# EAGLE design generator (EAGLE 6.5.0)
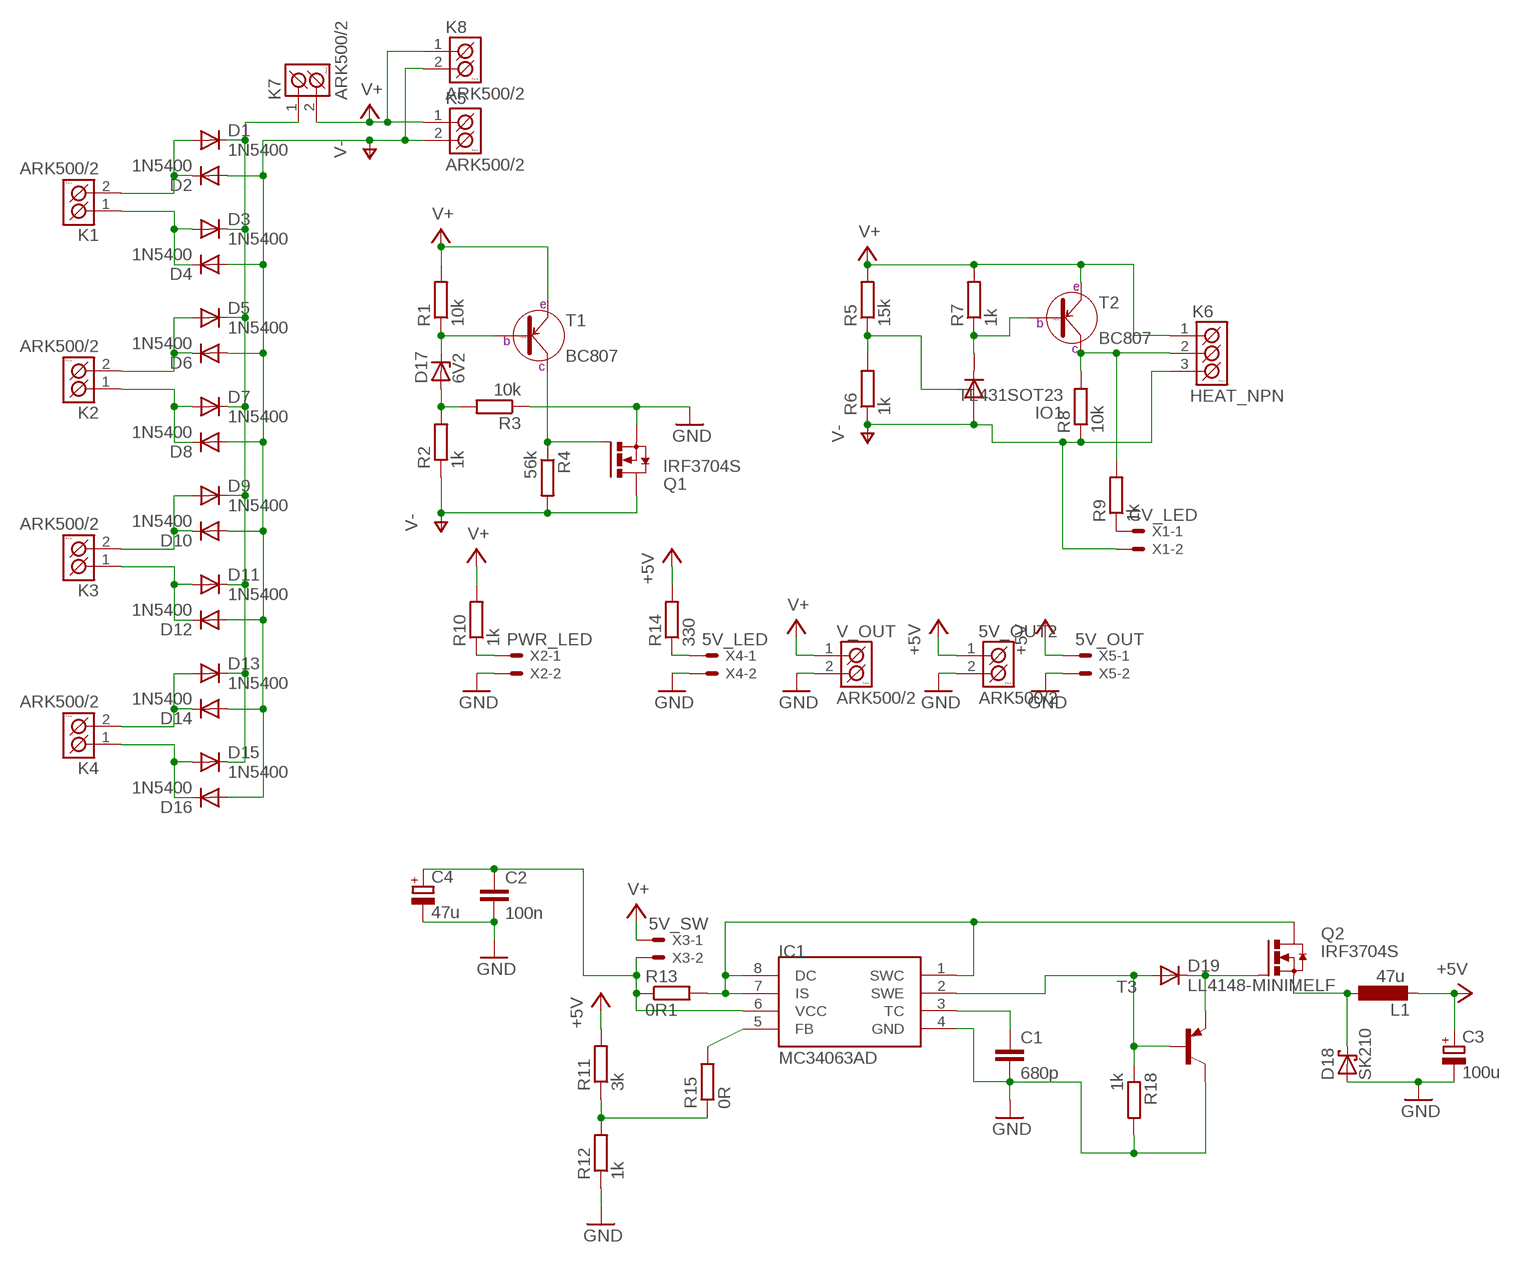
[diagram p0: schematic, sheet 1]

## Parts
5V_OUT2  ARK500/2  [ARK500/2]
C1  680p  C-EUC0805  [C0805]
C2  100n  C-EUC0805  [C0805]
C3  100u  CPOL-EUD  [PANASONIC_D]
C4  47u  CPOL-EUD  [PANASONIC_D]
D1  1N5400  [DO201-15]
D2  1N5400  [DO201-15]
D3  1N5400  [DO201-15]
D4  1N5400  [DO201-15]
D5  1N5400  [DO201-15]
D6  1N5400  [DO201-15]
D7  1N5400  [DO201-15]
D8  1N5400  [DO201-15]
D9  1N5400  [DO201-15]
D10  1N5400  [DO201-15]
D11  1N5400  [DO201-15]
D12  1N5400  [DO201-15]
D13  1N5400  [DO201-15]
D14  1N5400  [DO201-15]
D15  1N5400  [DO201-15]
D16  1N5400  [DO201-15]
D17  6V2  ZENER-DIODESOD80C  [SOD80C]
D18  SK210  SCHOTTKY-DIODESMD  [SMB]
D19  LL4148-MINIMELF  PMLL41SOD80C  [SOD80C]
IC1  MC34063AD  [SOIC8]
IO1  TL431SOT23  [SOT23]
K1  ARK500/2  [ARK500/2]
K2  ARK500/2  [ARK500/2]
K3  ARK500/2  [ARK500/2]
K4  ARK500/2  [ARK500/2]
K5  ARK500/2  [ARK500/2]
K6  HEAT_NPN  ARK500/3  [ARK500/3]
K7  ARK500/2  [ARK500/2]
K8  ARK500/2  [ARK500/2]
L1  47u  L-EUTJ3-U1  [TJ3-U1]
Q1  IRF3704S  [D2PACK]
Q2  IRF3704S  [D2PACK]
R1  10k  R-EU_R0805  [R0805]
R2  1k  R-EU_R0805  [R0805]
R3  10k  R-EU_R0805  [R0805]
R4  56k  R-EU_R0805  [R0805]
R5  15k  R-EU_R0805  [R0805]
R6  1k  R-EU_R0805  [R0805]
R7  1k  R-EU_R0805  [R0805]
R8  10k  R-EU_R0805  [R0805]
R9  1k  R-EU_R0805  [R0805]
R10  1k  R-EU_R0805  [R0805]
R11  3k  R-EU_R0805  [R0805]
R12  1k  R-EU_R0805  [R0805]
R13  0R1  R-EU_R0805  [R0805]
R14  330  R-EU_R0805  [R0805]
R15  0R  R-EU_R1206  [R1206]
R18  1k  R-EU_R0805  [R0805]
T1  BC807  [SOT-23]
T2  BC807  [SOT-23]
T3  BC807-16-PNP-SOT23-BEC  [SOT23-BEC]
V_OUT  ARK500/2  [ARK500/2]
X1  CV_LED  22-23-2021  [22-23-2021]
X2  PWR_LED  22-23-2021  [22-23-2021]
X3  5V_SW  22-23-2021  [22-23-2021]
X4  5V_LED  22-23-2021  [22-23-2021]
X5  5V_OUT  22-23-2021  [22-23-2021]

## Nets
+5V: 5V_OUT2.1(K1) C3.+ L1.2 R11.2 R14.2 X5.1
GND: 5V_OUT2.2(K2) C1.2 C2.2 C3.- C4.- D18.A IC1.4(GND) Q1.3(S) R3.1 R12.1 R18.2 T3.C V_OUT.2(K2) X2.2 X4.2 X5.2
N$1: D1.A D2.C K1.2(K2)
N$2: D3.A D4.C K1.1(K1)
N$3: IO1.1(C) R7.1 T2.1(B)
N$4: Q1.1(G) R4.1 T1.3(C)
N$5: D5.A D6.C K2.2(K2)
N$6: D7.A D8.C K2.1(K1)
N$7: K6.2(K2) R8.2 R9.2 T2.3(C)
N$8: R9.1 X1.1
N$9: D9.A D10.C K3.2(K2)
N$10: D11.A D12.C K3.1(K1)
N$11: R11.1 R12.2 R15.1
N$12: IO1.2(R) R5.1 R6.2
N$13: D13.A D14.C K4.2(K2)
N$14: D15.A D16.C K4.1(K1)
N$15: D19.C Q2.1(G) T3.E
N$16: C1.1 IC1.3(TC)
N$17: D17.C R1.1 T1.1(B)
N$18: D17.A R2.2 R3.2
N$19: D18.C L1.1 Q2.3(S)
N$20: D1.C D3.C D5.C D7.C D9.C D11.C D13.C D15.C K7.1(K1)
N$21: IC1.5(FB) R15.2
N$22: R14.1 X4.1
N$23: R10.1 X2.1
N$24: C2.1 C4.+ IC1.6(VCC) R13.1 X3.2
N$27: IC1.1(SWC) IC1.7(IS) IC1.8(DC) Q2.2(D) R13.2
N$28: D19.A IC1.2(SWE) R18.1 T3.B
V+: K5.1(K1) K6.1(K1) K7.2(K2) K8.1(K1) R1.2 R5.2 R7.2 R10.2 T1.2(E) T2.2(E) V_OUT.1(K1) X3.1
V-: D2.A D4.A D6.A D8.A D10.A D12.A D14.A D16.A IO1.3(A) K5.2(K2) K6.3(K3) K8.2(K2) Q1.2(D) R2.1 R4.2 R6.1 R8.1 X1.2

## Library data of the parts
5V_OUT2 K1-K5 K7 K8 V_OUT = #PaJa_konektory:ARK500/2: Svorkovnice - roztec 5mm - dvojita
C1 C2 = rcl:C-EU: CAPACITOR, European symbol
C3 C4 = rcl:CPOL-EU: POLARIZED CAPACITOR, European symbol
D1-D16 = diode:1N5400: DIODE standard rectifier, 3 A, 50 V (Motorola)
D17 = diode:ZENER-DIODE: Z-Diode
D18 = diode:SCHOTTKY-DIODE: Schottky Diode
D19 = diode:PMLL41*: High-speed diodes Source: http://www.semiconductors.philips.com/acrobat_download/datasheets/PMLL4150_2.pdf
IC1 = mc34063:MC34063
IO1 = references:TL431: Programmable Shunt Regulator TL431 Features > Programmable Output Voltage to 36 Volts > Low Dynamic Output Impedance 0.2? Typical > Sink Current Capability of 1.0 to 100mA > Equivalent Full-Range Temperature Coefficient of 50ppm/°C Typical > Temperature Compensated For Operation Over Full Rated Operating Temperature Range > Low Output Noise Voltage > Fast Turn-on Response; MPN: TL431BFDT; OC_FARNELL: 2095471; PACKAGE: SOT23; SUPPLIER: NXP
K6 = #PaJa_konektory:ARK500/3: Svorkovnice - roztec 5mm - trojita
L1 = rcl:L-EU: INDUCTOR, European symbol
Q1 Q2 = transistor-power:IRF3704: SMPS MOSFET HEXFET® Power MOSFET Source: http://www.irf.com/product-info/datasheets/data/irf3704.pdf
R1-R15 = rcl:R-EU_: RESISTOR, European symbol
R18 = resistor:R-EU_: RESISTOR, European symbol
T1 T2 = #PaJa_30:BC807: SMD tranzistor - PNP - ekv. BC327
T3 = transistor:*-PNP-: PNP Transistror
X1-X5 = con-molex:22-23-2021: .100" (2.54mm) Center Header - 2 Pin; MF: MOLEX; MPN: 22-23-2021; OC_FARNELL: 1462926; OC_NEWARK: 25C3832

## Board
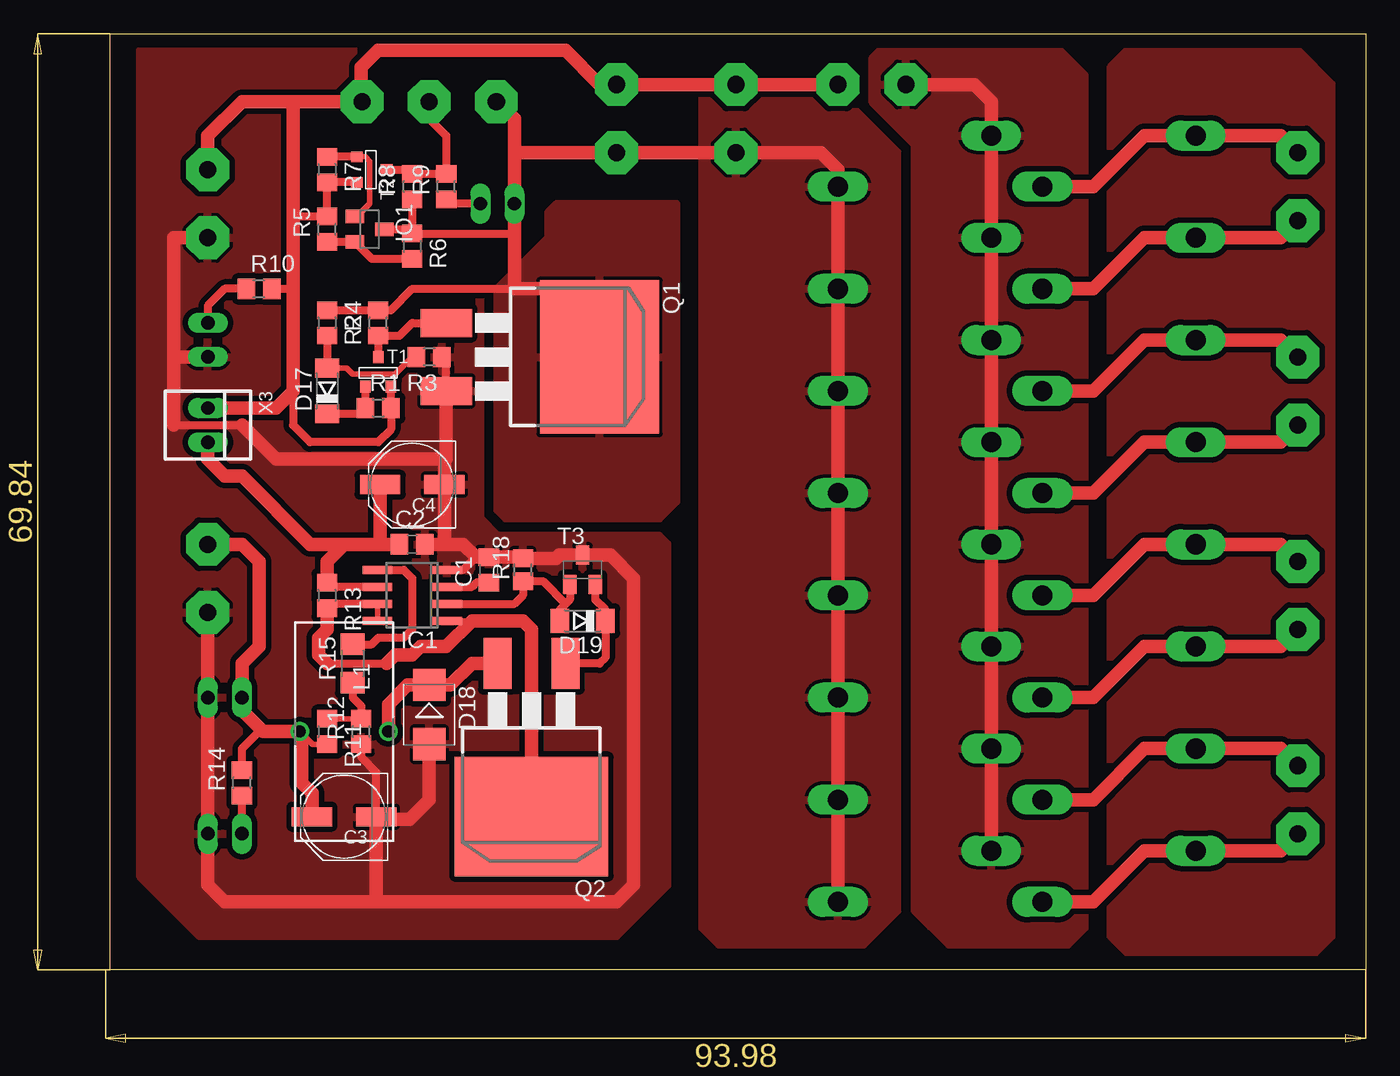
[diagram p1: board, top side]
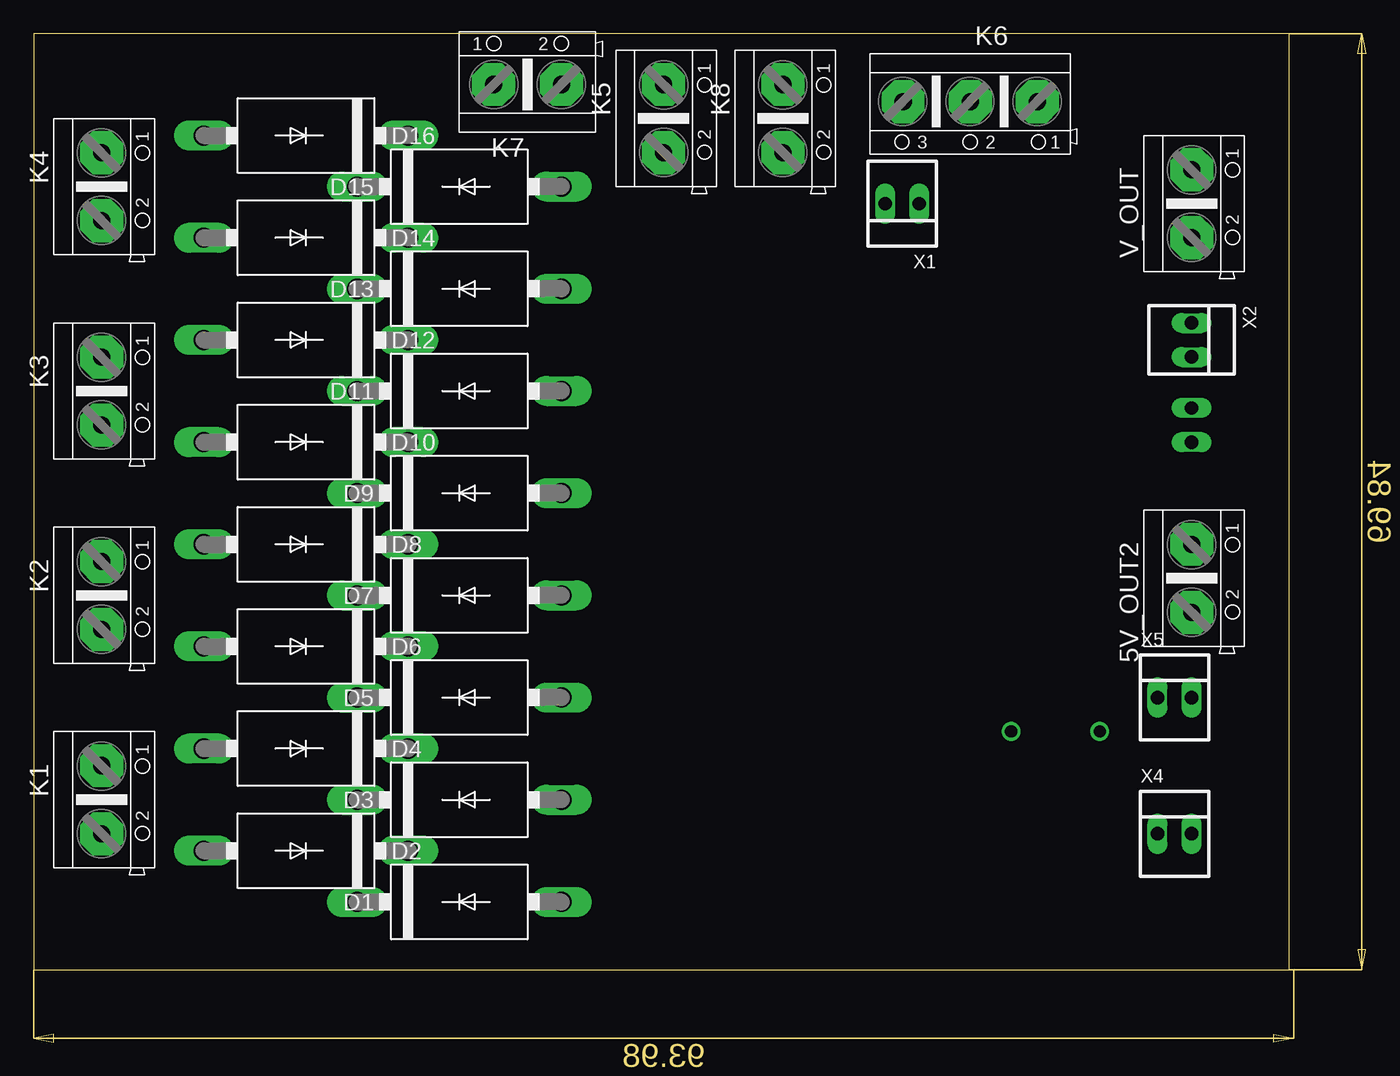
[diagram p2: board, bottom side, seen from below]

Size 93.65 x 69.84 mm. Coordinates in mm from the lower left corner, seen from the top.
Outline: 93.65,0 0,0 0,69.84 93.65,69.84 93.65,0
Copper layers (1*16): Top 0.035mm / dielectric 1.5mm / Bottom 0.035mm
Design rules "default": minimum track width 10mil, minimum drill 24mil, track to track 8mil, track to pad 8mil, pad to pad 8mil, via to via 8mil, smd to smd 8mil, copper to edge 40mil, drill to drill 8mil, minimum pad ring 10mil, minimum via ring 8mil, stop-mask expansion 4mil, vias tented up to drill 0mil, thermal gap 10mil

### Footprints (pad centres in the part's own frame; a part is rotated, then mirrored left to right if it is on the bottom)
ARK500/2 = drill 1.27 pad 3.2 octagon: 1 -2.54,0; 2 2.54,0
C0805 = smd 1.3 x 1.5: 1 -0.95,0; 2 0.95,0
PANASONIC_D = smd 3 x 1.4: + 2.4,0; - -2.4,0
DO201-15 = drill 1.499 long: A 7.62,0; C -7.62,0
SOD80C = smd 1.4 x 1.8: A 1.7,0; C -1.7,0
SMB = smd 2.4 x 2.4: A 2.2,0; C -2.2,0
SOIC8 = smd 0.6 x 2.2: 1 -1.905,-2.6; 2 -0.635,-2.6; 3 0.635,-2.6; 4 1.905,-2.6; 5 1.905,2.6; 6 0.635,2.6; 7 -0.635,2.6; 8 -1.905,2.6
SOT23 = smd 1 x 1.4: 1 -0.95,-1.1; 2 0.95,-1.1; 3 0,1.1
ARK500/3 = drill 1.27 pad 3.2 octagon: 1 -5,0; 2 0,0; 3 5,0
TJ3-U1 = drill 0.9: 1 -3.3,0; 2 3.3,0
D2PACK = smd 2.083 x 3.81: 1 -2.54,-8.89; 3 2.54,-8.89 | smd 11.43 x 8.89: 2 0,2.54
R0805 = smd 1.3 x 1.5: 1 -0.95,0; 2 0.95,0
R1206 = smd 1.6 x 1.803: 1 -1.422,0; 2 1.422,0
R0805' = smd 1.3 x 1.5: 1 -0.85,0; 2 0.85,0
SOT-23 = smd 0.787 x 0.889: 1 -0.953,-0.953; 2 0.953,-0.953; 3 0,1.27
SOT23-BEC = smd 1 x 1.4: B -0.95,-1.1; C 0,1.1; E 0.95,-1.1
22-23-2021 = drill 1 long: 1 -1.27,0; 2 1.27,0

### Placement (x,y rotation side)
5V_OUT2  7.29,29.21 270 bottom
C1  28.25,29.85 90 top
C2  22.53,31.75 0 top
C3  17.45,11.43 180 top
C4  22.53,36.19 180 top
D1  73.33,8.89 180 bottom
D2  61.9,5.08 0 bottom
D3  73.33,16.51 180 bottom
D4  61.9,12.7 0 bottom
D5  73.33,24.13 180 bottom
D6  61.9,20.32 0 bottom
D7  73.33,31.75 180 bottom
D8  61.9,27.94 0 bottom
D9  73.33,39.37 180 bottom
D10  61.9,35.56 0 bottom
D11  73.33,46.99 180 bottom
D12  61.9,43.18 0 bottom
D13  73.33,54.61 180 bottom
D14  61.9,50.8 0 bottom
D15  73.33,62.23 180 bottom
D16  61.9,58.42 0 bottom
D17  16.18,43.18 90 top
D18  23.8,19.05 270 top
D19  35.23,26.04 180 top
IC1  22.53,27.94 90 top
IO1  19.36,55.25 270 top
K1  88.57,12.7 270 bottom
K2  88.57,27.94 270 bottom
K3  88.57,43.18 270 bottom
K4  88.57,58.42 270 bottom
K5  46.66,63.5 270 bottom
K6  23.8,64.77 180 bottom
K7  56.82,66.04 0 bottom
K8  37.77,63.5 270 bottom
L1  17.45,17.78 180 top
Q1  33.96,45.72 270 top
Q2  31.42,13.97 180 top
R1  19.99,41.91 0 top
R2  16.18,48.26 270 top
R3  23.8,45.72 180 top
R4  19.99,48.26 90 top
R5  16.18,55.25 90 top
R6  22.53,53.98 270 top
R7  16.18,59.69 270 top
R8  22.53,58.42 90 top
R9  25.07,58.42 90 top
R10  11.1,50.8 0 top
R11  16.18,17.78 270 top
R12  18.72,17.78 90 top
R13  16.18,27.94 270 top
R14  9.83,13.97 90 top
R15  18.09,22.86 90 top
R18  1k  [R0805']  30.79,29.85 90 top
T1  19.99,44.45 0 top
T2  19.36,59.69 270 top
T3  35.23,29.85 0 top
V_OUT  7.29,57.15 270 bottom
X1  28.88,57.15 180 bottom
X2  7.29,46.99 270 bottom
X3  7.29,40.64 270 top
X4  8.56,10.16 0 bottom
X5  8.56,20.32 0 bottom

### Tracks (layer width: path | path; a pad name or v marks a point on that pad's centre or on a via)
+5V
  Top 0.406: 14.28,17.14 13.64,17.78 | R11.2 15.1,16.83 L1.2
  Top 0.61: 11.26,17.94 9.83,16.51 R14.2
  Top 1.016: 5V_OUT2.1 9.83,31.75 11.1,30.48 11.1,24.13 9.83,22.86 X5.1 9.83,19.37 11.26,17.94 11.42,17.78 13.64,17.78 L1.2 | C3.+ 15.05,13.2 14.28,13.97 14.28,17.14
GND
  Top 0.406: 25.07,45.4 R3.1 | 6.02,26.67 5V_OUT2.2 | 24.93,31.89 25.07,31.75 | 19.85,5.22 19.99,5.08 | 24.93,37.96 25.07,38.1 | 20.03,11.25 C3.- | 30.68,30.79 R18.2 | 33.24,30.69 33.49,30.94
  Top 0.61: Q1.3 25.07,45.4 | 4.75,40.64 9.83,40.64 | R12.1 18.72,15.88 19.85,14.75 C3.- | IC1.4 26.34,29.85 27.29,30.79
  Top 1.016: 5V_OUT2.2 X5.2 X4.2 7.29,6.35 8.56,5.08 19.99,5.08 37.77,5.08 39.04,6.35 39.04,29.21 37.3,30.94 T3.C 33.49,30.94 | X2.2 4.75,45.72 | 4.75,45.72 4.75,40.64 | 9.83,40.64 12.37,38.1 25.07,38.1 Q1.3 | V_OUT.2 4.75,54.61 4.75,45.72 | C2.2 25.07,31.75 26.34,31.75 27.29,30.79 C1.2 30.68,30.79 | 24.93,31.89 C4.- 24.93,37.96 | C3.- 19.85,5.22 | 20.03,11.25 22.35,11.25 23.8,12.7 D18.A | R18.2 33.24,30.69
  pour Top (isolate 0.406): 41.58,31.75 40.95,32.39 28.88,32.39 27.61,33.66 27.61,53.34 32.69,58.42 32.69,69.85 3.48,69.85 2.21,68.58 2.21,6.98 6.66,2.54 37.77,2.54 41.58,6.35
N$1
  Top 1.016: K1.2 87.3,8.89 D1.A 77.14,8.89 73.33,5.08 D2.C
N$2
  Top 1.016: K1.1 87.3,16.51 D3.A 77.14,16.51 73.33,12.7 D4.C
N$3
  Top 0.406: R7.1 | IO1.1 18.4,56.2 19.36,57.15 19.36,60.33 19.04,60.64 T2.1
  Top 0.61: T2.1 R7.1
N$4
  Top 0.61: T1.3 R4.1 21.58,47.31 22.53,48.26 Q1.1
N$5
  Top 1.016: K2.2 87.3,24.13 D5.A 77.14,24.13 73.33,20.32 D6.C
N$6
  Top 1.016: K2.1 87.3,31.75 D7.A 77.14,31.75 73.33,27.94 D8.C
N$7
  Top 0.406: 22.21,59.69 R8.2
  Top 0.61: K6.2 23.8,63.5 25.07,62.23 R9.2 R8.2 | T2.3 22.21,59.69
N$8
  Top 0.406: 25.39,57.15 R9.1
  Top 0.61: X1.1 25.39,57.15
N$9
  Top 1.016: K3.2 87.3,39.37 D9.A 77.14,39.37 73.33,35.56 D10.C
N$10
  Top 1.016: K3.1 87.3,46.99 D11.A 77.14,46.99 73.33,43.18 D12.C
N$11
  Top 0.406: R11.1 R12.2
  Top 0.61: R15.1 18.09,20.32 18.72,19.68 R12.2
N$12
  Top 0.61: R6.2 19.52,53.03 IO1.2 R5.1
N$13
  Top 1.016: K4.2 87.3,54.61 D13.A 77.14,54.61 73.33,50.8 D14.C
N$14
  Top 1.016: K4.1 87.3,62.23 D15.A 77.14,62.23 73.33,58.42 D16.C
N$15
  Top 0.61: T3.E 36.18,27.62 36.93,26.87 D19.C 36.93,23.29 36.5,22.86 Q2.1
N$16
  Top 0.61: IC1.3 26.98,28.57 27.3,28.89 C1.1
N$17
  Top 0.406: 18.61,41.48 R1.1 | T1.1
  Top 0.61: D17.C 18.61,41.48 | R1.1 T1.1
N$18
  Top 0.406: R3.2 22.53,45.72 21.26,44.45 18.09,44.45 17.66,44.88 D17.A
  Top 0.61: R2.2 D17.A
N$19
  Top 1.016: Q2.3 26.98,22.86 25.36,21.25 D18.C 22.19,21.25 20.75,19.81 L1.1
N$20
  Top 1.016: D1.C D3.C D5.C D7.C D9.C D11.C D13.C D15.C 65.71,64.77 64.44,66.04 K7.1
  pour Top (isolate 0.406): 70.79,68.58 57.45,68.58 56.82,67.95 56.82,64.77 59.99,61.59 59.99,4.45 62.53,1.9 71.42,1.9 72.69,3.18 72.69,66.67
N$21
  Top 0.61: IC1.5 21.89,29.85 22.53,29.21 22.53,25.4 21.89,24.76 19.99,24.76 19.51,24.28 R15.2
N$22
  Top 0.61: X4.1 R14.1
N$23
  Top 0.61: R10.1 8.56,50.8 7.29,49.53 X2.1
N$24
  Top 0.406: 16.5,28.57 R13.1 | 20.13,31.89 19.99,31.75
  Top 0.61: IC1.6 16.5,28.57
  Top 1.016: C2.1 19.99,31.75 17.45,31.75 | 17.45,31.75 16.18,30.48 R13.1 | C4.+ 20.13,31.89 | X3.2 7.29,38.1 8.56,36.83 9.83,36.83 14.91,31.75 17.45,31.75
N$25
  pour Top (isolate 0.406): 74.6,67.31 74.6,2.54 75.87,1.27 89.84,1.27 91.11,2.54 91.11,66.04 88.57,68.58 75.87,68.58
N$27
  Top 0.406: IC1.7 IC1.8 | 16.5,27.31 R13.2 | 25.07,26.04 IC1.1 26.98,26.04
  Top 0.61: IC1.7 16.5,27.31 | 16.18,22.86 20.62,22.86
  Top 1.016: Q2.2 31.42,25.4 30.79,26.04 26.98,26.04 25.07,24.13 23.16,24.13 22.53,23.5 21.26,23.5 20.62,22.86 | R13.2 16.18,25.4 15.54,24.76 15.54,23.5 16.18,22.86
N$28
  Top 0.61: IC1.2 30.15,27.31 30.79,27.94 R18.1 32.27,29 33.96,27.31 | T3.B 34.28,27.62 33.96,27.31 | D19.A 33.53,26.87 33.96,27.31
V+
  Top 0.406: T1.2 | 18.72,64.85 K6.1 | R7.2 | 7.29,58.42 V_OUT.1 | 13.96,56.2 13.64,55.88
  Top 0.61: T1.2 R1.2 20.94,40.32 19.99,39.37 14.91,39.37 13.64,40.64 13.64,43.18 | T2.2 R7.2 | R7.2 R5.2 13.96,56.2 | R10.2 13.64,50.8
  Top 1.016: K7.2 K5.1 K8.1 36.5,66.04 33.96,68.58 19.99,68.58 18.72,67.31 18.72,64.85 | 13.64,64.77 9.83,64.77 7.29,62.23 V_OUT.1 | K6.1 13.64,64.77 | 13.64,64.77 13.64,55.88 13.64,50.8 13.64,43.18 12.37,41.91 X3.1
V-
  Top 0.406: 32.69,50.8 32.69,49.53 35.87,46.36 Q1.2 | K6.3 28.88,64.77 | 22.21,55.25 R6.1 | 29.84,54.92 30.15,54.61
  Top 0.61: R2.1 R4.2 20.94,49.21 22.53,50.8 30.15,50.8 | R8.1 R6.1 29.84,54.92 | IO1.3 22.21,55.25
  Top 1.016: D2.A D4.A D6.A D8.A D10.A D12.A D14.A D16.A 54.28,59.69 53.01,60.96 K5.2 K8.2 30.15,60.96 | 36.5,46.99 35.87,46.36 | 28.88,64.77 30.15,63.5 30.15,60.96 | 30.15,60.96 X1.2 30.15,54.61 30.15,50.8 32.69,50.8
  pour Top (isolate 0.406): 28.88,34.29 28.88,50.8 32.69,54.61 32.69,56.52 33.33,57.15 42.22,57.15 42.22,34.92 40.95,33.66 29.52,33.66
  pour Top (isolate 0.406): 44.12,67.31 44.12,3.18 45.39,1.9 56.19,1.9 58.73,4.45 58.73,60.96 54.91,64.77 54.91,67.31 53.65,68.58 45.39,68.58